# Altium schematic sheet PowerManagement.SchDoc
size OrCAD A; SheetNumber: 2; SheetTotal: 4
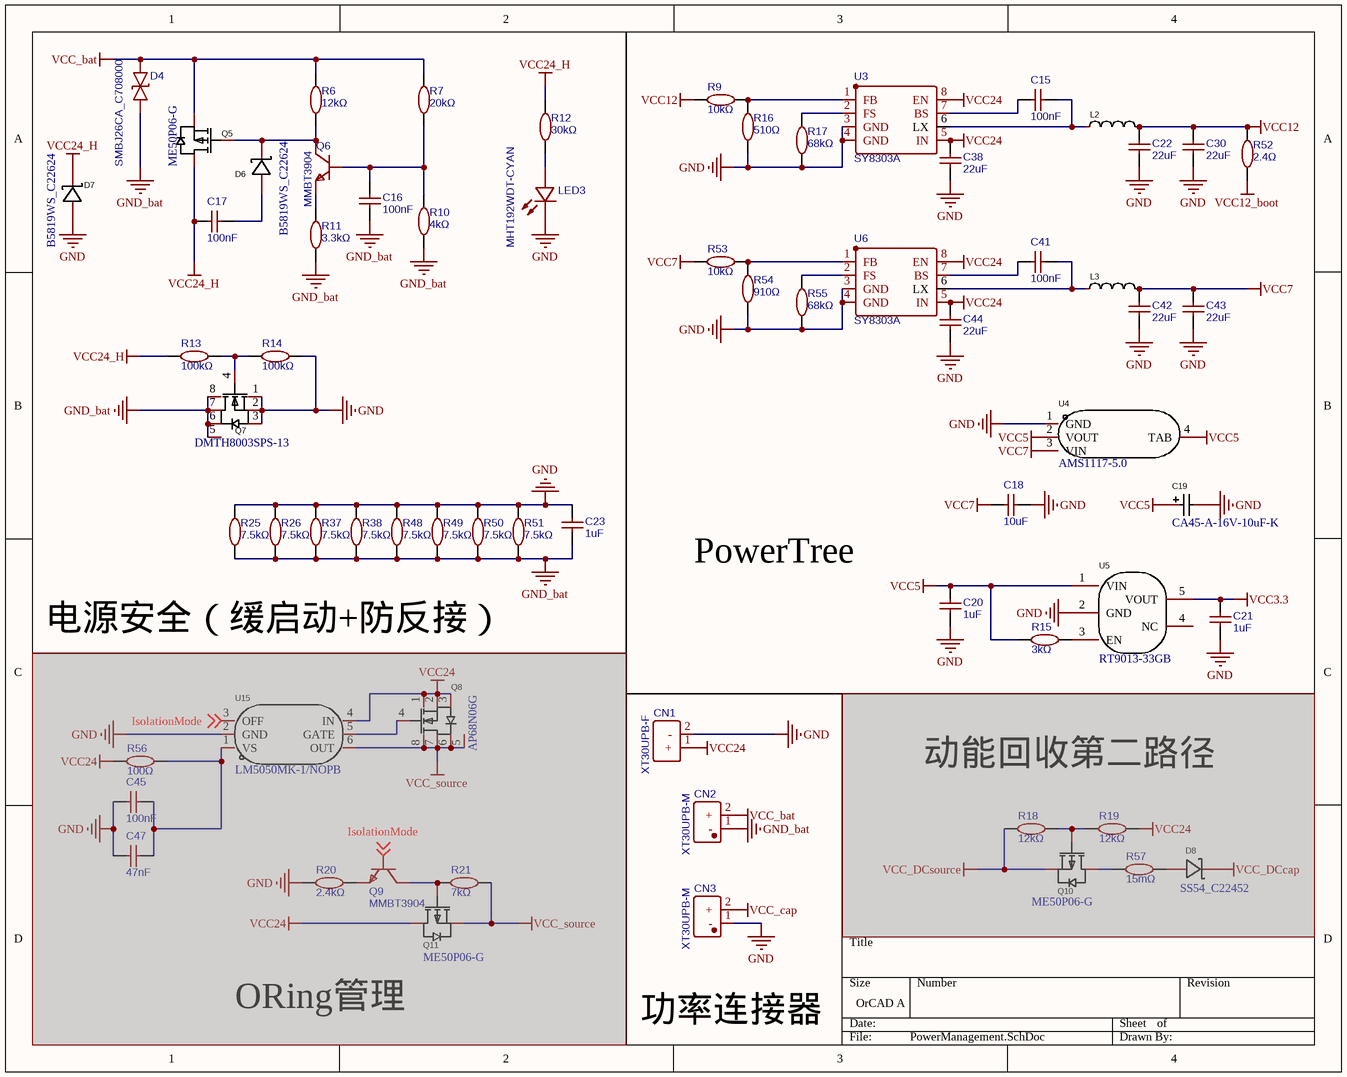
[diagram p0: PowerManagement.SchDoc]

## Parts
C15  100nF  [C-RAD-0603]
C16  100nF  [C-RAD-0603]
C17  100nF  [C-RAD-0603]
C18  10uF  [C-RAD-0805]
C19  CA45-A-16V-10uF-K  [CAP-3216]
C20  1uF  [C-RAD-0603]
C21  1uF  [C-RAD-0603]
C22  22uF  [C-RAD-0805]
C23  1uF  [C-RAD-0603]
C30  22uF  [C-RAD-0805]
C38  22uF  [C-RAD-0805]
C41  100nF  [C-RAD-0603]
C42  22uF  [C-RAD-0805]
C43  22uF  [C-RAD-0805]
C44  22uF  [C-RAD-0805]
C45  100nF  [C-RAD-0603]  (masked out: inside a compile mask, not in the netlist)
C47  47nF  [C-RAD-0805]  (masked out: inside a compile mask, not in the netlist)
CN1  XT30UPB-F  [CONN-TH_XT30UPB-F]
CN2  XT30UPB-M  [CONN-TH_XT30UPB-M]
CN3  XT30UPB-M  [CONN-TH_XT30UPB-M]
D4  SMBJ26CA_C708000  [SMB_L4.6-W3.6-LS5.3-BI]
D6  B5819WS_C22624  [SOD-323_L1.8-W1.3-LS2.5-BI]
D7  B5819WS_C22624  [SOD-323_L1.8-W1.3-LS2.5-BI]
D8  SS54_C22452  [SMA_L4.4-W2.8-LS5.4-R-RD]  (masked out: inside a compile mask, not in the netlist)
L2  MWSA0402S-100MT  [L-SMD-4.5]  (value not drawn)
L3  MWSA0402S-100MT  [L-SMD-4.5]  (value not drawn)
LED3  MHT192WDT-CYAN  [LED_0805]
Q5  ME50P06-G  [TO-252-2]
Q6  MMBT3904  [SOT-23]
Q7  DMTH8003SPS-13  [PowerDI5060-8]
Q8  AP68N06G  [VDFN8]  (masked out: inside a compile mask, not in the netlist)
Q9  MMBT3904  [SOT-23]  (masked out: inside a compile mask, not in the netlist)
Q10  ME50P06-G  [TO-252-2]  (masked out: inside a compile mask, not in the netlist)
Q11  ME50P06-G  [TO-252-2]  (masked out: inside a compile mask, not in the netlist)
R6  12kΩ  [0603-1]
R7  20kΩ  [0603-1]
R9  10kΩ  [0603-1]
R10  4kΩ  [0603-1]
R11  3.3kΩ  [0603-1]
R12  30kΩ  [0603-1]
R13  100kΩ  [0603-1]
R14  100kΩ  [0603-1]
R15  3kΩ  [0603-1]
R16  510Ω  [0603-1]
R17  68kΩ  [0603-1]
R18  12kΩ  [0603-1]  (masked out: inside a compile mask, not in the netlist)
R19  12kΩ  [0603-1]  (masked out: inside a compile mask, not in the netlist)
R20  2.4kΩ  [0603-1]  (masked out: inside a compile mask, not in the netlist)
R21  7kΩ  [0603-1]  (masked out: inside a compile mask, not in the netlist)
R25  7.5kΩ  [0805-1]
R26  7.5kΩ  [0805-1]
R37  7.5kΩ  [0805-1]
R38  7.5kΩ  [0805-1]
R48  7.5kΩ  [0805-1]
R49  7.5kΩ  [0805-1]
R50  7.5kΩ  [0805-1]
R51  7.5kΩ  [0805-1]
R52  2.4Ω  [0603-1]
R53  10kΩ  [0603-1]
R54  910Ω  [0603-1]
R55  68kΩ  [0603-1]
R56  100Ω  [0603-1]  (masked out: inside a compile mask, not in the netlist)
R57  15mΩ  [2512]  (masked out: inside a compile mask, not in the netlist)
U3  SY8303A  [TSOT23-8]
U4  AMS1117-5.0  [SOT-223]
U5  RT9013-33GB  [SOT-23-5_L3.0-W1.7-P0.95-LS2.8-BL]
U6  SY8303A  [TSOT23-8]
U15  LM5050MK-1/NOPB  [TSOT23-6]  (masked out: inside a compile mask, not in the netlist)

## Nets
GND: C18.2 C19.2 C20.2 C21.2 C22.1 C23.2 C30.1 C38.1 C42.1 C43.1 C44.1 CN1.2(-) CN3.1(-) D7.2(A) LED3.2(K) Q7.1(S) Q7.2(S) Q7.3(S) R14.1 R16.1 R17.1 R25.2 R26.2 R37.2 R38.2 R48.2 R49.2 R50.2 R51.2 R54.1 R55.1 U3.3(GND) U3.4(GND) U4.1(GND) U5.2(GND) U6.3(GND) U6.4(GND)
GND_bat: C16.1 C23.1 CN2.1(-) D4.1 Q7.5(D) Q7.6(D) Q7.7(D) Q7.8(D) R10.1 R11.1 R25.1 R26.1 R37.1 R38.1 R48.1 R49.1 R50.1 R51.1
VCC3.3: C21.1 U5.5(VOUT)
VCC5: C19.1 C20.1 R15.1 U4.2(VOUT) U4.4(TAB) U5.1(VIN)
VCC7: C18.1 C42.2 C43.2 L3.2 R53.1 U4.3(VIN)
VCC12: C22.2 C30.2 L2.2 R9.1 R52.1
VCC12_boot: R52.2
VCC24: C38.2 C44.2 CN1.1(+) U3.5(IN) U3.8(EN) U6.5(IN) U6.8(EN)
VCC24_H: C17.2 D7.1(K) Q5.2(D) R12.2 R13.2
VCC_bat: CN2.2(+) D4.2 Q5.3(S) R6.2 R7.2
VCC_cap: CN3.2(+)
NetC15_1: C15.1 L2.1 U3.6(LX)
NetC15_2: C15.2 U3.7(BS)
NetC16_2: C16.2 Q6.1(B) R7.1 R10.2
NetC17_1: C17.1 D6.2(A)
NetC41_1: C41.1 L3.1 U6.6(LX)
NetC41_2: C41.2 U6.7(BS)
NetD6_1: D6.1(K) Q5.1(G) Q6.3(C) R6.1
NetLED3_1: LED3.1(A) R12.1
NetQ6_2: Q6.2(E) R11.2
NetQ7_4: Q7.4(G) R13.1 R14.2
NetR9_2: R9.2 R16.2 U3.1(FB)
NetR15_2: R15.2 U5.3(EN)
NetR17_2: R17.2 U3.2(FS)
NetR53_2: R53.2 R54.2 U6.1(FB)
NetR55_2: R55.2 U6.2(FS)

Not connected (* = marked no-connect by the designer): U5 4(NC)

## Notes on the sheet
- PowerTree
- 电源安全（缓启动+防反接）
- 动能回收第二路径
- ORing管理
- 功率连接器

## Library data of the parts
C15-C17 C41 C45 = 100nF: BOM_Manufacturer: Guangdong Fenghua Advanced Tech; BOM_Manufacturer Part: 0805CG330J500NT; nameAlias: Capacitance; Contributor: LCSC; BOM_Supplier: LCSC; BOM_Supplier Part: C157687; BOM_JLCPCB Part Class: Extended Part; spicePre: C; spiceSymbolName: 0805CG330J500NT
C18 = 10uF: BOM_Manufacturer: Guangdong Fenghua Advanced Tech; BOM_Manufacturer Part: 0805CG330J500NT; nameAlias: Capacitance; Contributor: LCSC; BOM_Supplier: LCSC; BOM_Supplier Part: C157687; BOM_JLCPCB Part Class: Extended Part; spicePre: C; spiceSymbolName: 0805CG330J500NT
C19 = CA45-A-16V-10uF-K: Manufacturer: CEC(振华新云); Name: 10uF; Add into BOM: yes; Value: 10uF; Tolerance: ±10%; Rated Voltage: 16V; Equivalent Series Resistance(ESR): 10Ω@100kHz; Symbol: CA45-A-16V-10UF-K; Device: CA45-A-16V-10uF-K; LCSC Part Name: 10uF ±10% 16V; Supplier Part: C128254; Manufacturer Part: CA45-A-16V-10uF-K; Supplier Footprint: CASE-A-3216; JLCPCB Part Class: Extended Part; Datasheet: https://atta.szlcsc.com/upload/public/pdf/source/20170914/C128254_1505359752472967905.pdf; Supplier: LCSC; Convert to PCB: yes; Operating Temperature: -55℃~+125℃
C20 C21 C23 = 1uF: BOM_Manufacturer: Guangdong Fenghua Advanced Tech; BOM_Manufacturer Part: 0805CG330J500NT; nameAlias: Capacitance; Contributor: LCSC; BOM_Supplier: LCSC; BOM_Supplier Part: C157687; BOM_JLCPCB Part Class: Extended Part; spicePre: C; spiceSymbolName: 0805CG330J500NT
C22 C30 C38 C42-C44 = 22uF: BOM_Manufacturer: Guangdong Fenghua Advanced Tech; BOM_Manufacturer Part: 0805CG330J500NT; nameAlias: Capacitance; Contributor: LCSC; BOM_Supplier: LCSC; BOM_Supplier Part: C157687; BOM_JLCPCB Part Class: Extended Part; spicePre: C; spiceSymbolName: 0805CG330J500NT
C47 = 47nF: CL21B473KBCNNNC; BOM_Manufacturer: Guangdong Fenghua Advanced Tech; nameAlias: Capacitance; Contributor: LCSC; BOM_Supplier: LCSC; BOM_Supplier Part: C157687; BOM_Manufacturer Part: CL21B473KBCNNNC; BOM_JLCPCB Part Class: Extended Part; spicePre: C; spiceSymbolName: 0805CG330J500NT
CN1 = XT30UPB-F: BOM_Manufacturer: Changzhou Amass Elec; nameAlias: Value; Contributor: LCSC; BOM_Supplier: LCSC; BOM_Supplier Part: C108769; BOM_Manufacturer Part: XT30UPB-F; BOM_JLCPCB Part Class: Extended Part; spicePre: C; spiceSymbolName: XT30UPB-F
CN2 CN3 = XT30UPB-M: BOM_Manufacturer: Changzhou Amass Elec; Contributor: LCSC; BOM_Supplier: LCSC; BOM_Supplier Part: C428721; BOM_Manufacturer Part: XT30UPB-M; BOM_JLCPCB Part Class: Extended Part; spicePre: C; spiceSymbolName: XT30UPB-M
D4 = SMBJ26CA_C708000: BOM_Manufacturer: FTR; Contributor: LCSC; BOM_Supplier: LCSC; BOM_Supplier Part: C708000; BOM_Manufacturer Part: SMBJ26CA; BOM_JLCPCB Part Class: Extended Part; spicePre: D; spiceSymbolName: SMBJ26CA_C708000
D6 D7 = B5819WS_C22624: Manufacturer: CJ(江苏长电/长晶); Add into BOM: yes; Reverse Voltage (Vr): 40V; Average Rectified Current (Io): 1A; Forward Voltage (Vf@If): 600mV@1A; Name: B5819WS; Symbol: B5819WS_C22624; Device: B5819WS_C22624; LCSC Part Name: 40V 1A 600mV@1A; Supplier Part: C22624; Manufacturer Part: B5819WS; Supplier Footprint: SOD-323; JLCPCB Part Class: Extended Part; Datasheet: https://atta.szlcsc.com/upload/public/pdf/source/20170919/C22624_1505799673448977596.pdf; Supplier: LCSC; Convert to PCB: yes
D8 = SS54_C22452: Manufacturer: MDD; Name: SS54; Add into BOM: yes; Reverse Voltage (Vr): 40V; Average Rectified Current (Io): 5A; Forward Voltage (Vf@If): 550mV@5A; Symbol: SS54_C22452; Device: SS54_C22452; LCSC Part Name: 40V 5A 550mV@5A; Supplier Part: C22452; Manufacturer Part: SS54; Supplier Footprint: SMA(DO-214AC); JLCPCB Part Class: Basic Part; Datasheet: https://atta.szlcsc.com/upload/public/pdf/source/20190306/C22452_DC5E4F74C3B638F6D8E4C7650D5BF30E.pdf; Supplier: LCSC; Convert to PCB: yes
L2 L3 = MWSA0402S-100MT: Manufacturer: Sunlord(顺络); Name: 10uH; Add into BOM: yes; Value: 10uH; Tolerance: ±20%; Rated Current: 1.6A; Saturation Current (Isat): 2A; DC Resistance (DCR): 282mΩ; Symbol: MWSA0402S-100MT; Device: MWSA0402S-100MT; LCSC Part Name: 10uH ±20% 2A; Supplier Part: C408339; Manufacturer Part: MWSA0402S-100MT; Supplier Footprint: SMD; JLCPCB Part Class: Extended Part; Datasheet: https://atta.szlcsc.com/upload/public/pdf/source/20190729/C408339_3BC98729F1BEEFAE5AEBBEB66576AB79.pdf; Supplier: LCSC; Convert to PCB: yes; Type: -; Ratings: -
LED3 = MHT192WDT-CYAN: BOM_Manufacturer: MEIHUA; Contributor: LCSC; BOM_Supplier: LCSC; BOM_Supplier Part: C496821; BOM_Manufacturer Part: MHT192WDT-CYAN; BOM_JLCPCB Part Class: Extended Part; spicePre: L; spiceSymbolName: MHT192WDT-CYAN
Q5 Q10 Q11 = ME50P06-G: Manufacturer: MATSUKI(松木); Add into BOM: yes; Type: P沟道; Drain Source Voltage (Vdss): 60V; Continuous Drain Current (Id): 61A; Power Dissipation (Pd): 114W; Drain Source On Resistance (RDS(on)@Vgs,Id): 17mΩ@10V,17A; Gate Threshold Voltage (Vgs(th)@Id): 3V@250μA; Name: ME50P06-G; Symbol: ME50P06; Device: ME50P06-G; LCSC Part Name: P沟道 60V 61A; Supplier Part: C165230; Manufacturer Part: ME50P06-G; Supplier Footprint: TO-252-2(DPAK); JLCPCB Part Class: Extended Part; Datasheet: https://atta.szlcsc.com/upload/public/pdf/source/20180316/EC2C67353FCE0BEDF2188A18E5230379.pdf; Supplier: LCSC; Convert to PCB: yes
Q6 Q9 = MMBT3904: BOM_Manufacturer: High Diode; BOM_Manufacturer Part: S8050; Contributor: LCSC; BOM_Supplier: LCSC; BOM_Supplier Part: C466625; BOM_JLCPCB Part Class: Extended Part; spicePre: Q; spiceSymbolName: S8050_C466625
Q7 = DMTH8003SPS-13: Manufacturer: AOS; Name: AO3400A; Device: AO3400A_C20917; Add into BOM: yes; Type: N沟道; Drain Source Voltage (Vdss): 30V; Continuous Drain Current (Id): 5.7A; Power Dissipation (Pd): 1.4W; Drain Source On Resistance (RDS(on)@Vgs,Id): 26.5mΩ@10V,5.7A; Gate Threshold Voltage (Vgs(th)@Id): 1.5V@250μA; Symbol: AO3400A; LCSC Part Name: N沟道 30V 5.7A; Supplier Part: C20917; Manufacturer Part: AO3400A; Supplier Footprint: SOT-23-3L; JLCPCB Part Class: Basic Part; Datasheet: https://atta.szlcsc.com/upload/public/pdf/source/20140107/1457706668533.pdf; Supplier: LCSC; Convert to PCB: yes
Q8 = AP68N06G: Manufacturer: AOS; Name: AO3400A; Device: AO3400A_C20917; Add into BOM: yes; Type: N沟道; Drain Source Voltage (Vdss): 30V; Continuous Drain Current (Id): 5.7A; Power Dissipation (Pd): 1.4W; Drain Source On Resistance (RDS(on)@Vgs,Id): 26.5mΩ@10V,5.7A; Gate Threshold Voltage (Vgs(th)@Id): 1.5V@250μA; Symbol: AO3400A; LCSC Part Name: N沟道 30V 5.7A; Supplier Part: C20917; Manufacturer Part: AO3400A; Supplier Footprint: SOT-23-3L; JLCPCB Part Class: Basic Part; Datasheet: https://atta.szlcsc.com/upload/public/pdf/source/20140107/1457706668533.pdf; Supplier: LCSC; Convert to PCB: yes
R6 R18 R19 = 12kΩ: BOM_Manufacturer: UniOhm; BOM_Manufacturer Part: 0603WAF1002T5E; nameAlias: Resistance; Resistance (Ohms): 10K; BOM_Supplier: LCSC; BOM_Supplier Part: C25804; BOM_JLCPCB Part Class: Basic Part; spicePre: R; spiceSymbolName: 0603WAF1002T5E
R7 = 20kΩ: BOM_Manufacturer: UniOhm; BOM_Manufacturer Part: 0603WAF1002T5E; nameAlias: Resistance; Resistance (Ohms): 10K; BOM_Supplier: LCSC; BOM_Supplier Part: C25804; BOM_JLCPCB Part Class: Basic Part; spicePre: R; spiceSymbolName: 0603WAF1002T5E
R9 R53 = 10kΩ: BOM_Manufacturer: UniOhm; BOM_Manufacturer Part: 0603WAF1002T5E; nameAlias: Resistance; Resistance (Ohms): 10K; BOM_Supplier: LCSC; BOM_Supplier Part: C25804; BOM_JLCPCB Part Class: Basic Part; spicePre: R; spiceSymbolName: 0603WAF1002T5E
R10 = 4kΩ: BOM_Manufacturer: UniOhm; BOM_Manufacturer Part: 0603WAF1002T5E; nameAlias: Resistance; Resistance (Ohms): 10K; BOM_Supplier: LCSC; BOM_Supplier Part: C25804; BOM_JLCPCB Part Class: Basic Part; spicePre: R; spiceSymbolName: 0603WAF1002T5E
R11 = 3.3kΩ: BOM_Manufacturer: UniOhm; BOM_Manufacturer Part: 0603WAF1002T5E; nameAlias: Resistance; Resistance (Ohms): 10K; BOM_Supplier: LCSC; BOM_Supplier Part: C25804; BOM_JLCPCB Part Class: Basic Part; spicePre: R; spiceSymbolName: 0603WAF1002T5E
R12 = 30kΩ: BOM_Manufacturer: UniOhm; BOM_Manufacturer Part: 0603WAF1002T5E; nameAlias: Resistance; Resistance (Ohms): 10K; BOM_Supplier: LCSC; BOM_Supplier Part: C25804; BOM_JLCPCB Part Class: Basic Part; spicePre: R; spiceSymbolName: 0603WAF1002T5E
R13 R14 = 100kΩ: BOM_Manufacturer: UniOhm; BOM_Manufacturer Part: 0603WAF1002T5E; nameAlias: Resistance; Resistance (Ohms): 10K; BOM_Supplier: LCSC; BOM_Supplier Part: C25804; BOM_JLCPCB Part Class: Basic Part; spicePre: R; spiceSymbolName: 0603WAF1002T5E
R15 = 3kΩ: BOM_Manufacturer: UniOhm; BOM_Manufacturer Part: 0603WAF1002T5E; nameAlias: Resistance; Resistance (Ohms): 10K; BOM_Supplier: LCSC; BOM_Supplier Part: C25804; BOM_JLCPCB Part Class: Basic Part; spicePre: R; spiceSymbolName: 0603WAF1002T5E
R16 = 510Ω: BOM_Manufacturer: UniOhm; BOM_Manufacturer Part: 0603WAF1002T5E; nameAlias: Resistance; Resistance (Ohms): 10K; BOM_Supplier: LCSC; BOM_Supplier Part: C25804; BOM_JLCPCB Part Class: Basic Part; spicePre: R; spiceSymbolName: 0603WAF1002T5E
R17 R55 = 68kΩ: BOM_Manufacturer: UniOhm; BOM_Manufacturer Part: 0603WAF1002T5E; nameAlias: Resistance; Resistance (Ohms): 10K; BOM_Supplier: LCSC; BOM_Supplier Part: C25804; BOM_JLCPCB Part Class: Basic Part; spicePre: R; spiceSymbolName: 0603WAF1002T5E
R20 = 2.4kΩ: BOM_Manufacturer: UniOhm; BOM_Manufacturer Part: 0603WAF1002T5E; nameAlias: Resistance; Resistance (Ohms): 10K; BOM_Supplier: LCSC; BOM_Supplier Part: C25804; BOM_JLCPCB Part Class: Basic Part; spicePre: R; spiceSymbolName: 0603WAF1002T5E
R21 = 7kΩ: BOM_Manufacturer: UniOhm; BOM_Manufacturer Part: 0603WAF1002T5E; nameAlias: Resistance; Resistance (Ohms): 10K; BOM_Supplier: LCSC; BOM_Supplier Part: C25804; BOM_JLCPCB Part Class: Basic Part; spicePre: R; spiceSymbolName: 0603WAF1002T5E
R25 R26 R37 R38 R48-R51 = 7.5kΩ: BOM_Manufacturer: UniOhm; BOM_Manufacturer Part: 0603WAF1002T5E; nameAlias: Resistance; Resistance (Ohms): 10K; BOM_Supplier: LCSC; BOM_Supplier Part: C25804; BOM_JLCPCB Part Class: Basic Part; spicePre: R; spiceSymbolName: 0603WAF1002T5E
R52 = 2.4Ω: BOM_Manufacturer: UniOhm; BOM_Manufacturer Part: 0603WAF1002T5E; nameAlias: Resistance; Resistance (Ohms): 10K; BOM_Supplier: LCSC; BOM_Supplier Part: C25804; BOM_JLCPCB Part Class: Basic Part; spicePre: R; spiceSymbolName: 0603WAF1002T5E
R54 = 910Ω: BOM_Manufacturer: UniOhm; BOM_Manufacturer Part: 0603WAF1002T5E; nameAlias: Resistance; Resistance (Ohms): 10K; BOM_Supplier: LCSC; BOM_Supplier Part: C25804; BOM_JLCPCB Part Class: Basic Part; spicePre: R; spiceSymbolName: 0603WAF1002T5E
R56 = 100Ω: BOM_Manufacturer: UniOhm; BOM_Manufacturer Part: 0603WAF1002T5E; nameAlias: Resistance; Resistance (Ohms): 10K; BOM_Supplier: LCSC; BOM_Supplier Part: C25804; BOM_JLCPCB Part Class: Basic Part; spicePre: R; spiceSymbolName: 0603WAF1002T5E
R57 = 15mΩ: BOM_Manufacturer: UniOhm; BOM_Manufacturer Part: 0603WAF1002T5E; nameAlias: Resistance; Resistance (Ohms): 10K; BOM_Supplier: LCSC; BOM_Supplier Part: C25804; BOM_JLCPCB Part Class: Basic Part; spicePre: R; spiceSymbolName: 0603WAF1002T5E
U3 U6 = SY8303A: BOM_Manufacturer: Texas Instruments; BOM_Manufacturer Part: TPS5430DDAG4; Contributor: LCSC; BOM_Supplier: LCSC; BOM_Supplier Part: C201628; BOM_JLCPCB Part Class: Extended Part; spicePre: U; spiceSymbolName: TPS5430DDAG4
U4 = AMS1117-5.0: Manufacturer: UMW(广东友台半导体); Name: AMS1117-3.3; Symbol: AMS1117-3.3_C347222; Add into BOM: yes; Output Type: 固定; Output Polarity: 正; Number of Outputs: 1; Maximum Input Voltage: 18V; Output Voltage: 3.3V; Dropout Voltage: 1.3V@(1A); Output Current: 1A; Power Supply Rejection Ratio (PSRR): 60dB@(120Hz); Device: AMS1117-3.3_C347222; LCSC Part Name: 正 Vin=18V Vout=3.3V 1A 60dB@(120Hz); Supplier Part: C347222; Manufacturer Part: AMS1117-3.3; Supplier Footprint: SOT-223-4; JLCPCB Part Class: Extended Part; Datasheet: https://atta.szlcsc.com/upload/public/pdf/source/20211011/50CC665C22E3A66C08379A4A74BDA25C.pdf; Supplier: LCSC; Convert to PCB: yes
U5 = RT9013-33GB: Manufacturer: RICHTEK(台湾立锜); Add into BOM: yes; Output Type: 固定; Output Polarity: 正; Number of Outputs: 1; Maximum Input Voltage: 5.5V; Output Voltage: 3.3V; Dropout Voltage: 400mV@(500mA); Output Current: 500mA; Power Supply Rejection Ratio (PRSS): 50dB@(10kHz); Name: RT9013-33GB; Symbol: RT9013-33GB; Device: RT9013-33GB; LCSC Part Name: Vin=5.5V Vout=3.3V 500mA 50dB@(10kHz); Supplier Part: C47773; Manufacturer Part: RT9013-33GB; Supplier Footprint: SOT-23-5; JLCPCB Part Class: Extended Part; Datasheet: https://atta.szlcsc.com/upload/public/pdf/source/20150504/1457707282459.pdf; Supplier: LCSC; Convert to PCB: yes; Quiescent Current (Ground Current): -; Noise: -; Feature: -
U15 = LM5050MK-1/NOPB: Manufacturer: TI(德州仪器); Add into BOM: yes; Name: LM5050MK-1/NOPB; Symbol: LM5050MK-1/NOPB; Device: LM5050MK-1/NOPB; LCSC Part Name: LM5050MK-1/NOPB; Supplier Part: C129323; Manufacturer Part: LM5050MK-1/NOPB; Supplier Footprint: TSOT-23-6; JLCPCB Part Class: Extended Part; Datasheet: https://atta.szlcsc.com/upload/public/pdf/source/20170914/C129323_1505359957620968163.pdf; Supplier: LCSC; Convert to PCB: yes